# Altium schematic sheet DriveModule.SchDoc
size A
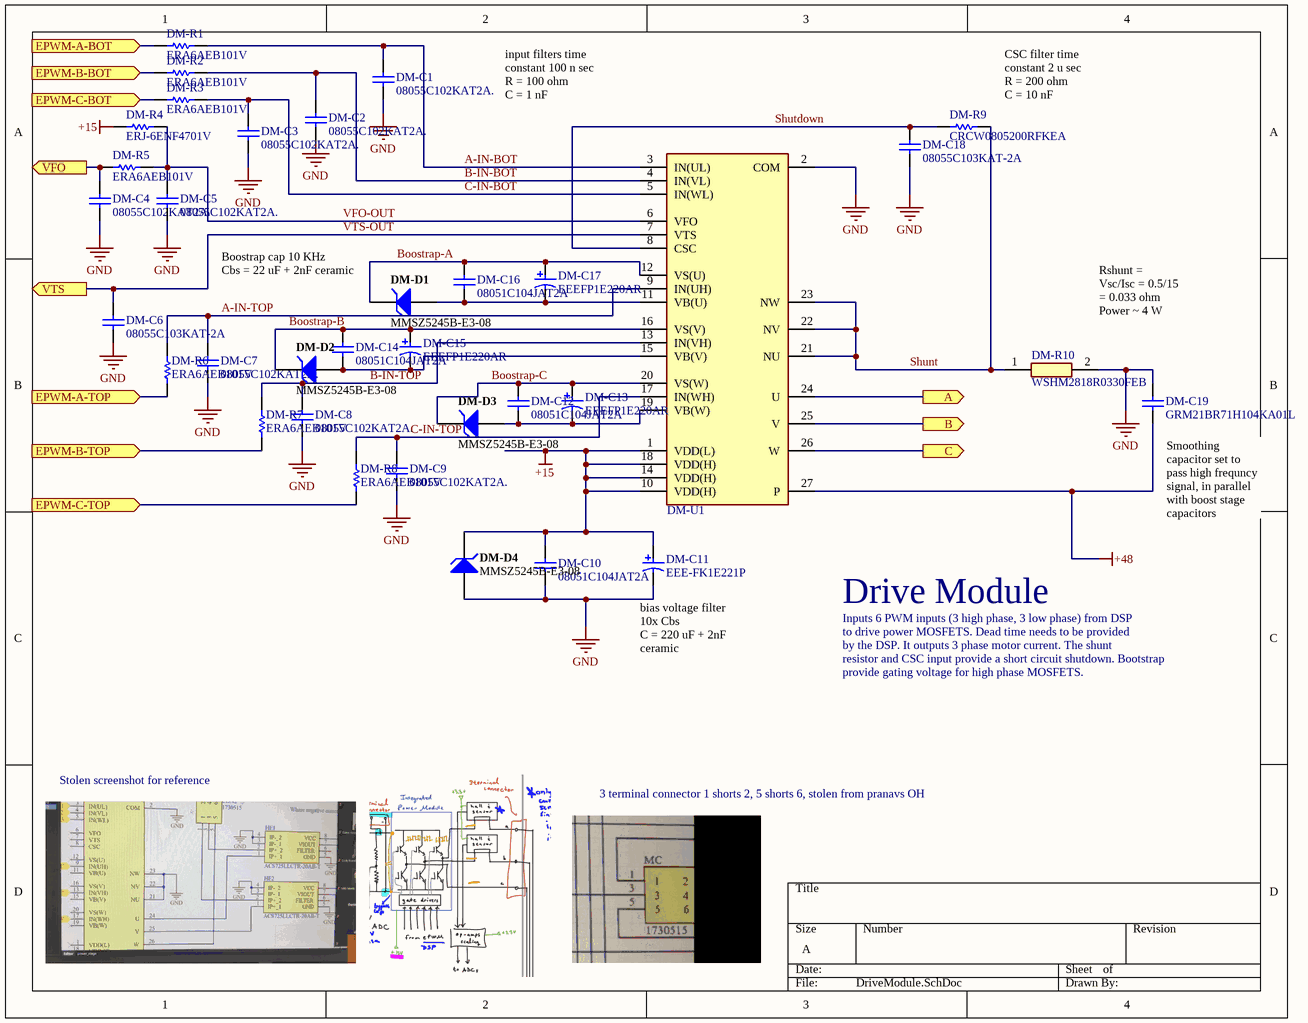
[diagram p0: DriveModule.SchDoc]

## Parts
DM-C1  08055C102KAT2A.  [CAPC2013X94X50ML20T25]
DM-C2  08055C102KAT2A.  [CAPC2013X94X50ML20T25]
DM-C3  08055C102KAT2A.  [CAPC2013X94X50ML20T25]
DM-C4  08055C102KAT2A.  [CAPC2013X94X50ML20T25]
DM-C5  08055C102KAT2A.  [CAPC2013X94X50ML20T25]
DM-C6  08055C103KAT-2A  [CAPC2013X94X50NL20T25]
DM-C7  08055C102KAT2A.  [CAPC2013X94X50ML20T25]
DM-C8  08055C102KAT2A.  [CAPC2013X94X50ML20T25]
DM-C9  08055C102KAT2A.  [CAPC2013X94X50ML20T25]
DM-C10  08051C104JAT2A  [CAPC2013X94X50ML20T25]
DM-C11  EEE-FK1E221P  [PNSC-EEE-FK1E221P_N]
DM-C12  08051C104JAT2A  [CAPC2013X94X50ML20T25]
DM-C13  EEEFP1E220AR  [PNSC-FP-V-C_V]
DM-C14  08051C104JAT2A  [CAPC2013X94X50ML20T25]
DM-C15  EEEFP1E220AR  [PNSC-FP-V-C_V]
DM-C16  08051C104JAT2A  [CAPC2013X94X50ML20T25]
DM-C17  EEEFP1E220AR  [PNSC-FP-V-C_V]
DM-C18  08055C103KAT-2A  [CAPC2013X94X50NL20T25]
DM-C19  GRM21BR71H104KA01L  [CAPC2013X135X45ML10T25]
DM-D1  MMSZ5245B-E3-08  [VISH-SOD-123-2_V]
DM-D2  MMSZ5245B-E3-08  [VISH-SOD-123-2_V]
DM-D3  MMSZ5245B-E3-08  [VISH-SOD-123-2_V]
DM-D4  MMSZ5245B-E3-08  [VISH-SOD-123-2_V]
DM-R1  ERA6AEB101V  [RESC2013X60X40ML20T25]
DM-R2  ERA6AEB101V  [RESC2013X60X40ML20T25]
DM-R3  ERA6AEB101V  [RESC2013X60X40ML20T25]
DM-R4  ERJ-6ENF4701V  [RESC2013X70X40NL20T20]
DM-R5  ERA6AEB101V  [RESC2013X60X40ML20T25]
DM-R6  ERA6AEB101V  [RESC2013X60X40ML20T25]
DM-R7  ERA6AEB101V  [RESC2013X60X40ML20T25]
DM-R8  ERA6AEB101V  [RESC2013X60X40ML20T25]
DM-R9  CRCW0805200RFKEA  [RESC2013X50X30NL20T20]
DM-R10  WSHM2818R0330FEB  [WSHM2818R0330FEB]
DM-U1  FNB34060T  [FNB34060T]  (value not drawn)

## Ports
A (out), B (out), C (out), EPWM-A-BOT (in), EPWM-A-TOP (in), EPWM-B-BOT (in), EPWM-B-TOP (in), EPWM-C-BOT (in), EPWM-C-TOP (in), VFO (out), VTS (out)

## Nets
+15: DM-C10.2 DM-C11.1 DM-D4.2(K) DM-R4.1 DM-U1.1(VDD(L)) DM-U1.10(VDD(H)) DM-U1.14(VDD(H)) DM-U1.18(VDD(H))
+48: DM-C19.1 DM-U1.27(P)
GND: DM-C1.1 DM-C2.1 DM-C3.1 DM-C4.1 DM-C5.1 DM-C6.1 DM-C7.1 DM-C8.1 DM-C9.1 DM-C10.1 DM-C11.2 DM-C18.1 DM-C19.2 DM-D4.1(A) DM-R10.2 DM-U1.2(COM)
A: DM-U1.24(U) ; port A
A-IN-BOT: DM-C1.2 DM-R1.2 DM-U1.3(IN(UL))
A-IN-TOP: DM-C7.2 DM-R6.2 DM-U1.9(IN(UH))
B: DM-U1.25(V) ; port B
B-IN-BOT: DM-C2.2 DM-R2.2 DM-U1.4(IN(VL))
B-IN-TOP: DM-C8.2 DM-R7.2 DM-U1.13(IN(VH))
Boostrap-A: DM-C16.2 DM-C17.1 DM-D1.2(K) DM-U1.12(VS(U))
Boostrap-B: DM-C14.2 DM-C15.1 DM-D2.2(K) DM-U1.16(VS(V))
Boostrap-C: DM-C12.2 DM-C13.1 DM-D3.2(K) DM-U1.20(VS(W))
C: DM-U1.26(W) ; port C
C-IN-BOT: DM-C3.2 DM-R3.2 DM-U1.5(IN(WL))
C-IN-TOP: DM-C9.2 DM-R8.2 DM-U1.17(IN(WH))
EPWM-A-BOT: DM-R1.1 ; port EPWM-A-BOT
EPWM-A-TOP: DM-R6.1 ; port EPWM-A-TOP
EPWM-B-BOT: DM-R2.1 ; port EPWM-B-BOT
EPWM-B-TOP: DM-R7.1 ; port EPWM-B-TOP
EPWM-C-BOT: DM-R3.1 ; port EPWM-C-BOT
EPWM-C-TOP: DM-R8.1 ; port EPWM-C-TOP
Shunt: DM-R9.1 DM-R10.1 DM-U1.21(NU) DM-U1.22(NV) DM-U1.23(NW)
Shutdown: DM-C18.2 DM-R9.2 DM-U1.8(CSC)
VFO: DM-C4.2 DM-R5.1 ; port VFO
VFO-OUT: DM-C5.2 DM-R4.2 DM-R5.2 DM-U1.6(VFO)
VTS-OUT: DM-C6.2 DM-U1.7(VTS) ; port VTS
NetDM-C12_1: DM-C12.1 DM-C13.2 DM-D3.1(A) DM-U1.19(VB(W))
NetDM-C14_1: DM-C14.1 DM-C15.2 DM-D2.1(A) DM-U1.15(VB(V))
NetDM-C16_1: DM-C16.1 DM-C17.2 DM-D1.1(A) DM-U1.11(VB(U))

## Notes on the sheet
- input filters time constant 100 n sec
  R = 100 ohm
  C = 1 nF
- (near DM-R9) CSC filter time constant 2 u sec
  R = 200 ohm
  C = 10 nF
- Boostrap cap 10 KHz
  Cbs = 22 uF + 2nF ceramic
- Rshunt = Vsc/Isc = 0.5/15 = 0.033 ohm
  Power ~ 4 W
- (near DM-C19) Smoothing capacitor set to pass high frequncy signal, in parallel with boost stage capacitors
- Drive Module
- Inputs 6 PWM inputs (3 high phase, 3 low phase) from DSP
- to drive power MOSFETS. Dead time needs to be provided
- (near DM-C11) bias voltage filter 10x Cbs
  C = 220 uF + 2nF ceramic
- by the DSP. It outputs 3 phase motor current. The shunt
- resistor and CSC input provide a short circuit shutdown. Bootstrap
- provide gating voltage for high phase MOSFETS.
- Stolen screenshot for reference
- 3 terminal connector 1 shorts 2, 5 shorts 6, stolen from pranavs OH

## Library data of the parts
DM-C1-DM-C5 DM-C7-DM-C9 = CMP-1036-02979-2: 1 nF cap; Manufacturer: AVX Interconnect / Elco; Part Number: 08055C102KAT2A.
DM-C6 DM-C18 = CMP-2007-04363-1: 10 nF cap; Manufacturer: AVX Interconnect / Elco; Part Number: 08055C103KAT-2A
DM-C10 DM-C12 DM-C14 DM-C16 = CMP-1036-04427-2: Manufacturer: AVX Interconnect / Elco; Part Number: 08051C104JAT2A
DM-C11 = CMP-1665-00017-3: Aluminum Electrolytic Capacitor, 220 uF, +/- 20%, 25 V, -55 to 105 degC, 2-Pin CAPAE, RoHS, Tape and Reel; Manufacturer: Panasonic; Voltage Rating: 25 V; ComponentLink2URL: http://industrial.panasonic.com/cdbs/www-data/pdf/RDE0000/ABA0000C1181.pdf; Height: 10.2 mm; Max Operating Temperature: 105 degC; PackageReference: EEE-FK1E221P; ComponentLink1Description: Manufacturer URL; ComponentLink1URL: http://www.panasonic.com/; Mount: Surface Mount; REACH SVHC: No SVHC; Min Operating Temperature: -55 degC; ComponentLink2Description: Datasheet; DatasheetVersion: 03/2016; Length: 10.2 mm; RoHSCompliant: true; Packaging: Tape and Reel; Package Quantity: 500; Lead Pitch: 3.1 mm; Pins: 2; PackageDescription: 2-Pin Electrolytic Aluminum Capacitor, Body 8.3 x 8.3 mm; Mounting Technology: Surface Mount
DM-C13 DM-C15 DM-C17 = CMP-2000-06213-1: Aluminum Electrolytic Capacitor, 22 uF, +/- 20%, 25 V, 2-Pin SMD (Size Code C), -55 to 105 degC, RoHS, Tape and Reel; Manufacturer: Panasonic; ESR (Equivalent Series Resistance): 0.36O; Ripple Current: 240mA; Capacitance: 22µF; Lifetime@Temperature: 2000Hrs@105°C; Rated Voltage: 25V; Package Reference: FP-V-C; Package Description: 2-Pin Electrolytic Aluminum Capacitor, Body 5.3 x 5.3 mm; Operating Temp Range: -55to+105°C; Mounting Technology: SurfaceMount; Datasheet URL: http://industrial.panasonic.com/cdbs/www-data/pdf/RDE0000/ABA0000C1184.pdf; Case Size/Dimension: Ø5x5.8mm; Operating Temp-Max: 105°C; Package URL: http://industrial.panasonic.com/cdbs/www-data/pdf/RDE0000/DME0000COL48.pdf; Datasheet Version: 03/2016; Series: FP; Manufacturer URL: http://www.panasonic.com/; Type: Can
DM-C19 = CMP-2100-03644-1: Chip Capacitor, 0.1 uF, +/- 10%, 50 V, -55 to 125 degC, 0805 (2012 Metric), RoHS, Tape and Reel; Manufacturer: Murata; Voltage: 50V; Capacitance: 100nF; Insulation Resistance: 10GR; Dielectric Material: Ceramic; Dielectric: X7R; Package Description: 2-Pin Surface Mount Device, Body 2 x 1.25 mm; Manufacturer URL: http://www.murata.com/; Case Code (Imperial): 0805; Datasheet URL: http://psearch.en.murata.com/capacitor/product/GRM21BR71H104KA01%23.pdf; Termination: SMD/SMT; Lead Free: LeadFree; Package Quantity: 1; Mount: SurfaceMount; REACH SVHC: Unknown; Thickness: 0.053inch; Height: 1.25mm; Case/Package: 0805; Voltage Rating: 50V; Width: 0.049inch; Case Code (Metric): 2012; Material: Ceramic; Min Operating Temperature: -55degC; RoHSCompliant: true; Datasheet Version: 42675.0; Voltage Rating (DC): 50V; Tolerance: 10%; Package Reference: 0805; Depth: 1.25mm; Length: 2mm; Max Operating Temperature: 125degC; Packaging: TapeandReel; Number of Pins: 2; Radiation Hardening: No
DM-D1-DM-D4 = CMP-0931-00033-1: Small Signal Zener Diode, 15 V +/- 5%, -55 to 155 degC, 2-Pin SOD-123, RoHS, Tape and Reel; Manufacturer: Vishay Semiconductor; Int. Construction: Single; Test Current (IZT1) (mA): 8.5; Zener Impedance (IZT1) (Max.) (Ohm): 16; Zener Voltage (NOM.) (V): 15; Power Dissipation (mW): 500; Tolerance: +/- 5%; PackageDescription: 2-Pin SMD, Body 2.7 x 1.55 mm, Height 1.35 mm; ComponentLink2Description: Datasheet; PackageVersion: Rev. 1.9; ComponentLink2URL: http://www.vishay.com/docs/85774/mmsz5225.pdf; RoHS: TRUE; Packing: Tape and Reel; Operating Temperature: -55 to 150 degC; ComponentLink1Description: Manufacturer URL; ComponentLink3Description: Package Specification; PackageReference: SOD-123-2; DatasheetVersion: Rev. 1.9; PartNumber: MMSZ5245B-E3-08; ComponentLink3URL: http://www.vishay.com/docs/85774/mmsz5225.pdf; Mounting Technology: Surface Mount; ComponentLink1URL: http://www.vishay.com/
DM-R1-DM-R3 DM-R6-DM-R8 = CMP-2001-00580-1: 100 ohm resistor; Manufacturer: Panasonic; Part Number: ERA6AEB101V
DM-R4 = CMP-2001-00550-5: Chip Resistor, 4.7 KOhm, +/- 1%, 0.125 W, -55 to 155 degC, 0805 (2012 Metric), RoHS, Tape and Reel; Manufacturer: Panasonic; Voltage Rating: 150 V; Min Operating Temperature: -55 degC; PackageReference: 0805; Mounting Technology: Surface Mount; Height: 0.6 mm; PackageDescription: 2-Pin Surface Mount Device, Body 2 x 1.25 mm; RoHSCompliant: true; Length: 2 mm; REACH SVHC: Yes; Packaging: Tape and Reel; Pins: 2; Mount: Surface Mount; ComponentLink2Description: Datasheet; ComponentLink1URL: http://www.panasonic.com/; ComponentLink1Description: Manufacturer URL; DatasheetVersion: 04/2015; Package Quantity: 5000; ComponentLink2URL: http://industrial.panasonic.com/cdbs/www-data/pdf/RDA0000/AOA0000C86.pdf; Max Operating Temperature: 155 degC
DM-R5 = CMP-2001-00580-1: Manufacturer: Panasonic; Part Number: ERA6AEB101V
DM-R9 = CMP-2001-03663-1: 200 ohm resistor; Manufacturer: Vishay Dale; Part Number: CRCW0805200RFKEA
DM-R10 = WSHM2818R0330FEB: Resistor; Manufacturer_Name: Vishay; Datasheet Link: https://componentsearchengine.com/Datasheets/2/WSHM2818R0330FEB.pdf; Height: 1.75mm; Manufacturer_Part_Number: WSHM2818R0330FEB; Mouser Part Number: 71-WSHM2818R0330FEB; Mouser Price/Stock: https://www.mouser.co.uk/ProductDetail/Vishay-Dale/WSHM2818R0330FEB?qs=Blj4iBE%2FJuORIC0JacTR6A%3D%3D
DM-U1 = FNB34060T: 3 phase power module